# EasyEDA Pro project Schematic1.epro

# Schematic Schematic1
Create Date: 2025-06-27; Page Name: P1; Project Name: AD8367可变增益放大器; Schematic Name: Schematic1; Update Date: 2025-06-30; Company: 深圳嘉立创科技集团股份有限公司; Drawed: LCEDA_02; Page Size: A4; Part Number: JLC-PCB-001; Reviewed: 嘉立创EDA; Version: V1.0
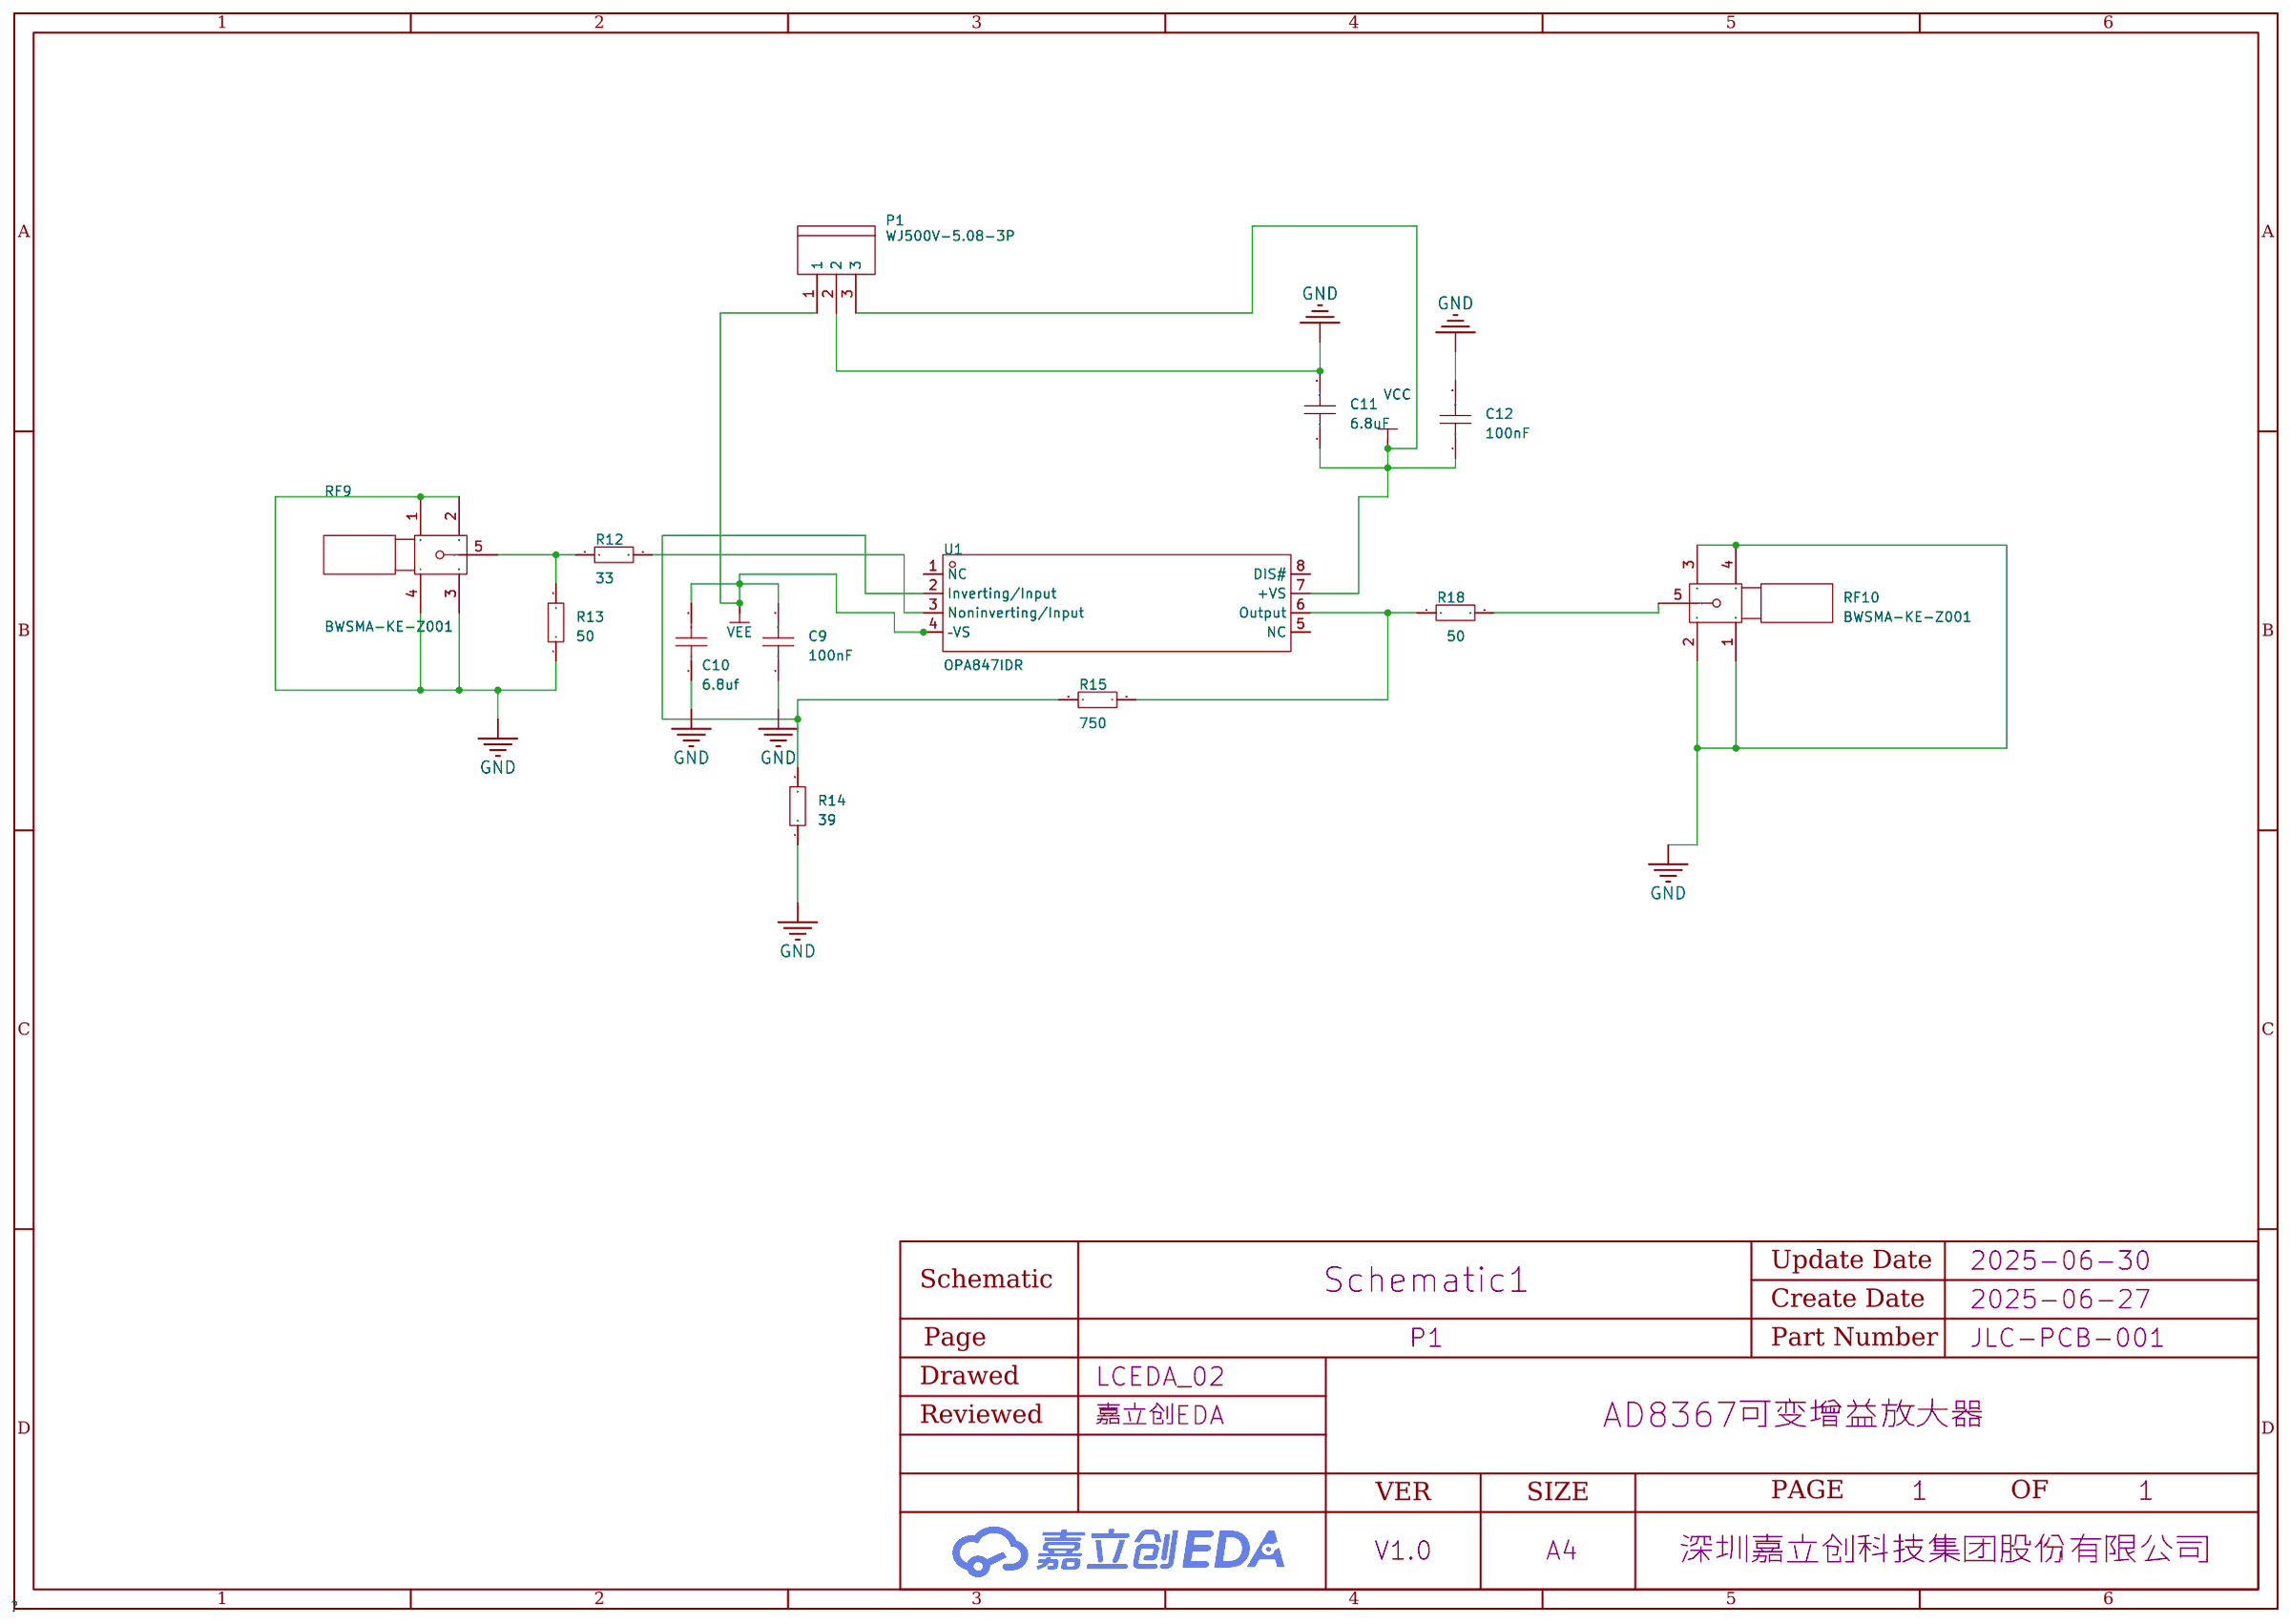
[diagram p0: schematic sheet]

## Parts
C9  100nF  [C0805]
C10  6.8uf  [C0805]
C11  6.8uF  [C0805]
C12  100nF  [C0805]
P1  WJ500V-5.08-3P  [CONN-TH_3P-P5.00_WJ500V-5.08-3P]
R12  33  [R0805]
R13  50  [R0805]
R14  39  [R0805]
R15  750  [R0805]
R18  50  [R0805]
RF9  BWSMA-KE-Z001  [SMA-TH_BWSMA-KE-Z001]
RF10  BWSMA-KE-Z001  [SMA-TH_BWSMA-KE-Z001]
U1  OPA847IDR  [SOIC-8_L4.9-W3.9-P1.27-LS6.0-TL]

## Library data of the parts
C9-C12 = CAP_0805: Supplier Footprint: 0805
P1 = WJ500V-5.08-3P: 结构:1x3P;间距:5.08mm;颜色:绿色;安装方式:直插;额定电流:18A;额定电压:250V;排数:1;线规 - AWG:14~30;线规 - 平方毫米:2.5;每排PIN数:3;工作温度范围:-40℃~+105℃;; LCSC Part Name: 5.08mm 1x3P 排数:1 每排P数:3 直插; Supplier Part: C72334; Manufacturer: KANGNEX(康奈克斯电气); Supplier Footprint: 插件,P=5.08mm; JLCPCB Part Class: 扩展库; Datasheet: https://atta.szlcsc.com/upload/public/pdf/source/20191225/C72334_8A5EF831D67650233B6B1E3F2BC06274.pdf; Supplier: LCSC; Structure: 1x3P; Pitch: 5.08mm; Color: 绿色; Mounting Style: 直插; Current Rating (Max): 18A; Voltage Rating (Max): 250V; Number of Pins: 3P; Number of Rows: 1; Wire Gauge - AWG: 14~30; Wire Gauge - mm2: 2.5; Number of PINs Per Row: 3; Operating Temperature Range: -40℃~+105℃
R12-R15 R18 = Res_0805: Supplier Footprint: 0805
RF9 RF10 = BWSMA-KE-Z001_C496549: 连接器类型:板端;接口类型:内孔;端口数量:1;接口直径:-;接口长度/高度:-;频率-最大值:-;射频系列:SMA;阻抗:50Ω;样式:正脚;触头材质:-;触头镀层:-;工作温度范围:-65℃~+165℃;焊接温度(最大值):-;; LCSC Part Name: 内孔 SMA 正脚; Supplier Part: C496549; Manufacturer: BAT WIRELESS(蝙蝠无线); Supplier Footprint: 插件; JLCPCB Part Class: 扩展库; Datasheet: https://atta.szlcsc.com/upload/public/pdf/source/20221228/40BF41E56A06003A0210E1785CA66EA6.pdf; Supplier: LCSC; Connector Type: 板端; Interface Type: 内孔; Number of Ports: 1; RF Series: SMA; Impedance: 50Ω; Style: 正脚; Operating Temperature Range: -65℃~+165℃
U1 = OPA847IDR: 放大器数:单路;增益带宽积(GBP):3.9GHz;压摆率(SR):950V/us;输入偏置电流(Ib):19uA;; Supplier Part: C2870028; Manufacturer: TI(德州仪器); Supplier Footprint: SOIC-8; JLCPCB Part Class: 扩展库; Datasheet: https://www.ti.com/cn/lit/gpn/opa847; Supplier: LCSC; Number of Circuits: 单路; Gain Bandwidth Product(GBP): 3.9GHz; Slew Rate(SR): 950V/us; Current - Input Bias(Ib): 19uA; Output Current: 100mA; Operating Temperature: -40℃~+85℃

## Nets
GND: C9.1 C10.1 C11.2 C12.2 P1.2 R13.1 R14.1 RF9.1 RF9.2 RF9.3 RF9.4 RF10.1 RF10.2 RF10.3 RF10.4
VCC: C11.1 C12.1 P1.3 U1.7(+VS)
VEE: C9.2 C10.2 P1.1 U1.4(–VS)
Net-(R12-1): R12.1 R13.2 RF9.5
Net-(R12-2): R12.2 U1.3(Noninverting/Input)
Net-(R14-2): R14.2 R15.1 U1.2(Inverting/Input)
Net-(R15-2): R15.2 R18.1 U1.6(Output)
Net-(R18-2): R18.2 RF10.5

Not connected (* = marked no-connect by the designer): U1 1(NC) 5(NC) 8(DIS#)
